# EAGLE design trim_switch (EAGLE 7.7.0)
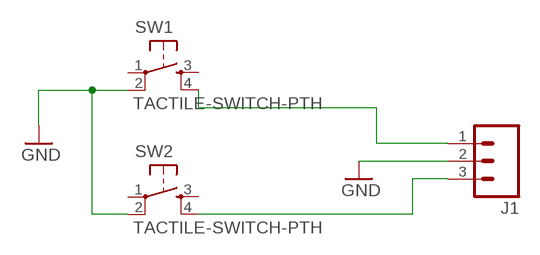
[diagram p0: schematic, sheet 1]

## Parts
J1  M03PTH  [1X03]
SW1  TACTILE-SWITCH-PTH  [TAC-SWITCH-PTH]
SW2  TACTILE-SWITCH-PTH  [TAC-SWITCH-PTH]

## Nets
GND: J1.2 SW1.2 SW2.2
N$1: J1.1 SW1.4
N$2: J1.3 SW2.4
Unconnected: SW1.1 SW1.3 SW2.1 SW2.3

## Library data of the parts
J1 = SparkFun-Connectors:M03: Header 3 Standard 3-pin 0.1" header. Use with straight break away headers (SKU : PRT-00116), right angle break away headers (PRT-00553), swiss pins (PRT-00743), machine pins (PRT-00117), and female headers (PRT-00115). Molex polarized connector foot print use with SKU : PRT-08232 with associated crimp pins and housings.
SW1 SW2 = GeekAmmo:TACTILE-SWITCH: Tactile Switch 4 Pins, SPST NO

## Board
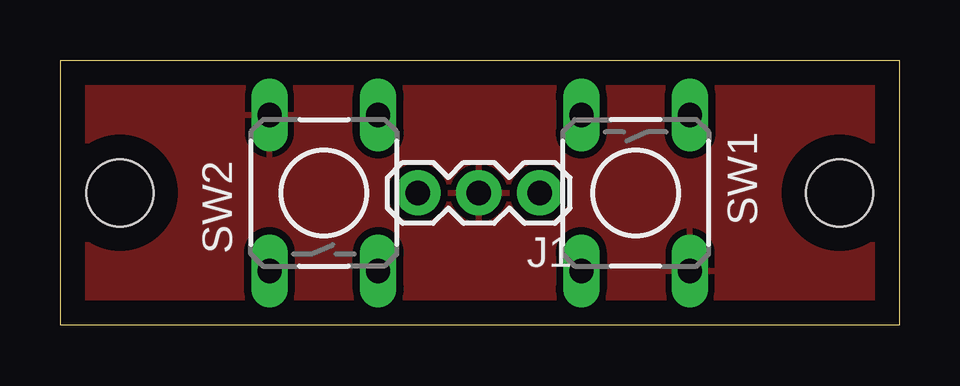
[diagram p1: board, top side]
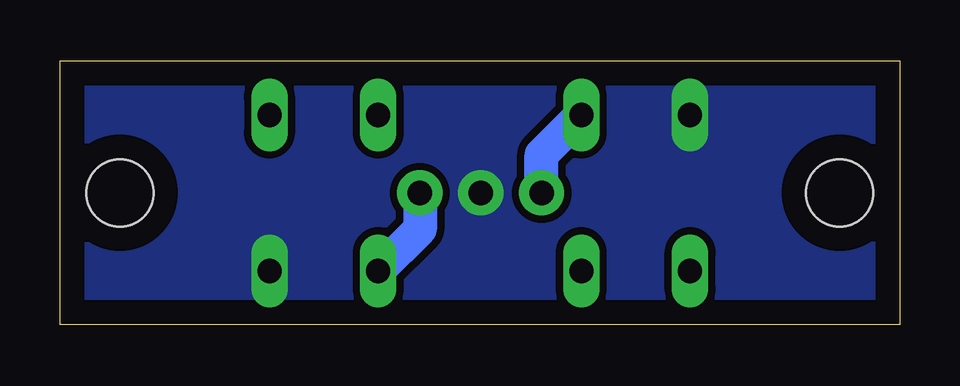
[diagram p2: board, bottom side, seen from below]

Size 35 x 11 mm. Coordinates in mm from the lower left corner, seen from the top.
Outline: 0,0 35,0 35,11 0,11 0,0
Copper layers (1*16): Top 0.035mm / dielectric 1.5mm / Bottom 0.035mm
Design rules "default": minimum track width 10mil, minimum drill 24mil, track to track 8mil, track to pad 8mil, pad to pad 8mil, via to via 8mil, smd to smd 8mil, copper to edge 40mil, drill to drill 8mil, minimum pad ring 10mil, minimum via ring 8mil, stop-mask expansion 4mil, vias tented up to drill 0mil, thermal gap 10mil
Holes 2.8 mm at 2.5,5.5 32.5,5.5

### Footprints (pad centres in the part's own frame; a part is rotated, then mirrored left to right if it is on the bottom)
1X03 = drill 1.016 pad 1.88: 1 0,0; 2 2.54,0; 3 5.08,0
TAC-SWITCH-PTH = drill 1.016 pad 1.524 long: 1 -3.251,2.261; 2 3.251,2.261; 3 -3.251,-2.261; 4 3.251,-2.261

### Placement (x,y rotation side)
J1  20,5.5 180 top
SW1  24,5.5 270 top
SW2  11,5.5 90 top

### Tracks (layer width: path | path; a pad name or v marks a point on that pad's centre or on a via)
GND
  pour Bottom (isolate 0.305, no thermals): 0,11 35,11 35,0 0,0
  pour Top (isolate 0.305): -0.5,11.5 35.5,11.5 35.5,-0.5 -0.5,-0.5
N$1
  Bottom 1.422: J1.1 20,3.99 SW1.4
N$2
  Bottom 1.422: J1.3 14.92,7.09 SW2.4